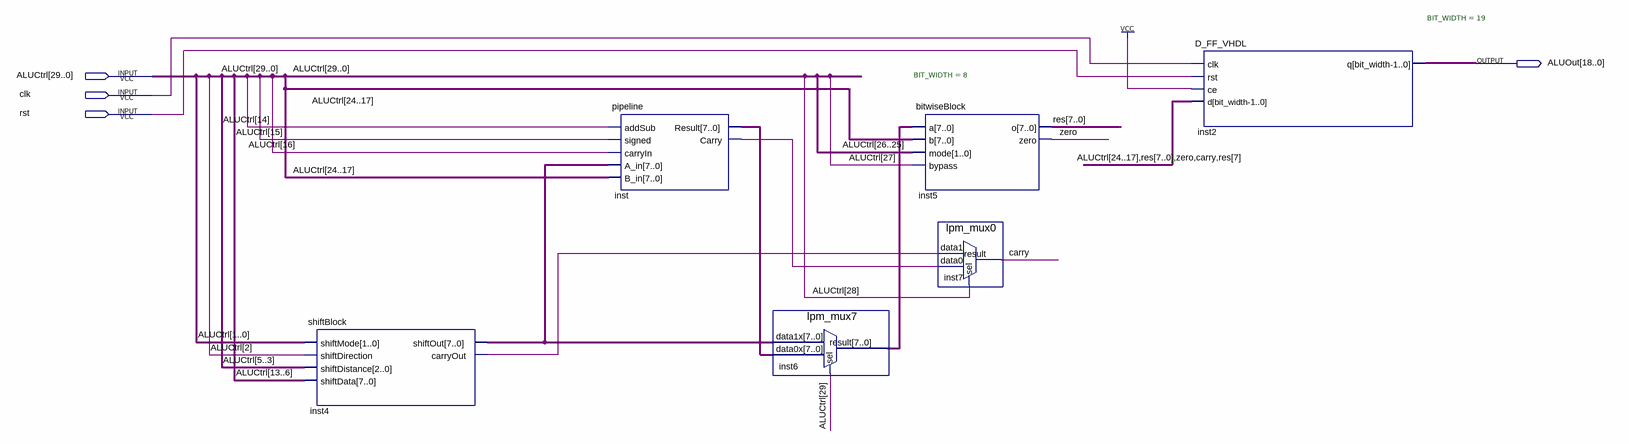
[diagram p0: schematic sheet]
// Quartus schematic ALU.bdf as structural Verilog: 6 symbols, 4 pins
module ALU (
  input  [29:0] ALUCtrl,
  input  clk,
  input  rst,
  output [18:0] ALUOut
);

  wire carry, inst4_carryout, inst_carry, zero;
  wire [7:0] inst4_shiftout, inst6_result, inst_result, res;

  shiftBlock inst4 (
    .shiftMode(ALUCtrl[1:0]), .shiftDirection(ALUCtrl[2]), .shiftDistance(ALUCtrl[5:3]),
    .shiftData(ALUCtrl[13:6]), .shiftOut(inst4_shiftout), .carryOut(inst4_carryout));
  pipeline inst (
    .addSub(ALUCtrl[14]), .\signed (ALUCtrl[15]), .carryIn(ALUCtrl[16]), .A_in(inst4_shiftout),
    .B_in(ALUCtrl[24:17]), .Result(inst_result), .Carry(inst_carry));
  lpm_mux7 inst6 (.data1x(inst4_shiftout), .data0x(inst_result), .sel(ALUCtrl[29]), .result(inst6_result));
  bitwiseBlock #(.BIT_WIDTH(8)) inst5 (
    .a(inst6_result), .b(ALUCtrl[24:17]), .mode(ALUCtrl[26:25]), .bypass(ALUCtrl[27]), .o(res), .zero(zero));
  lpm_mux0 inst7 (.data1(inst4_carryout), .data0(inst_carry), .sel(ALUCtrl[28]), .result(carry));
  D_FF_VHDL #(.BIT_WIDTH(19)) inst2 (
    .clk(clk), .rst(rst), .ce(1'b1), .d({ALUCtrl[24:17], res, zero, carry, res[7]}), .q(ALUOut));
endmodule
